# EasyEDA schematic 1-Schematic_LiveTelemtry.json
TITLE: Sheet_1; REV: 1.0; Date: 2025-11-05; Sheet: 1/1; Drawn By: zavierlau123; Company: Your Company
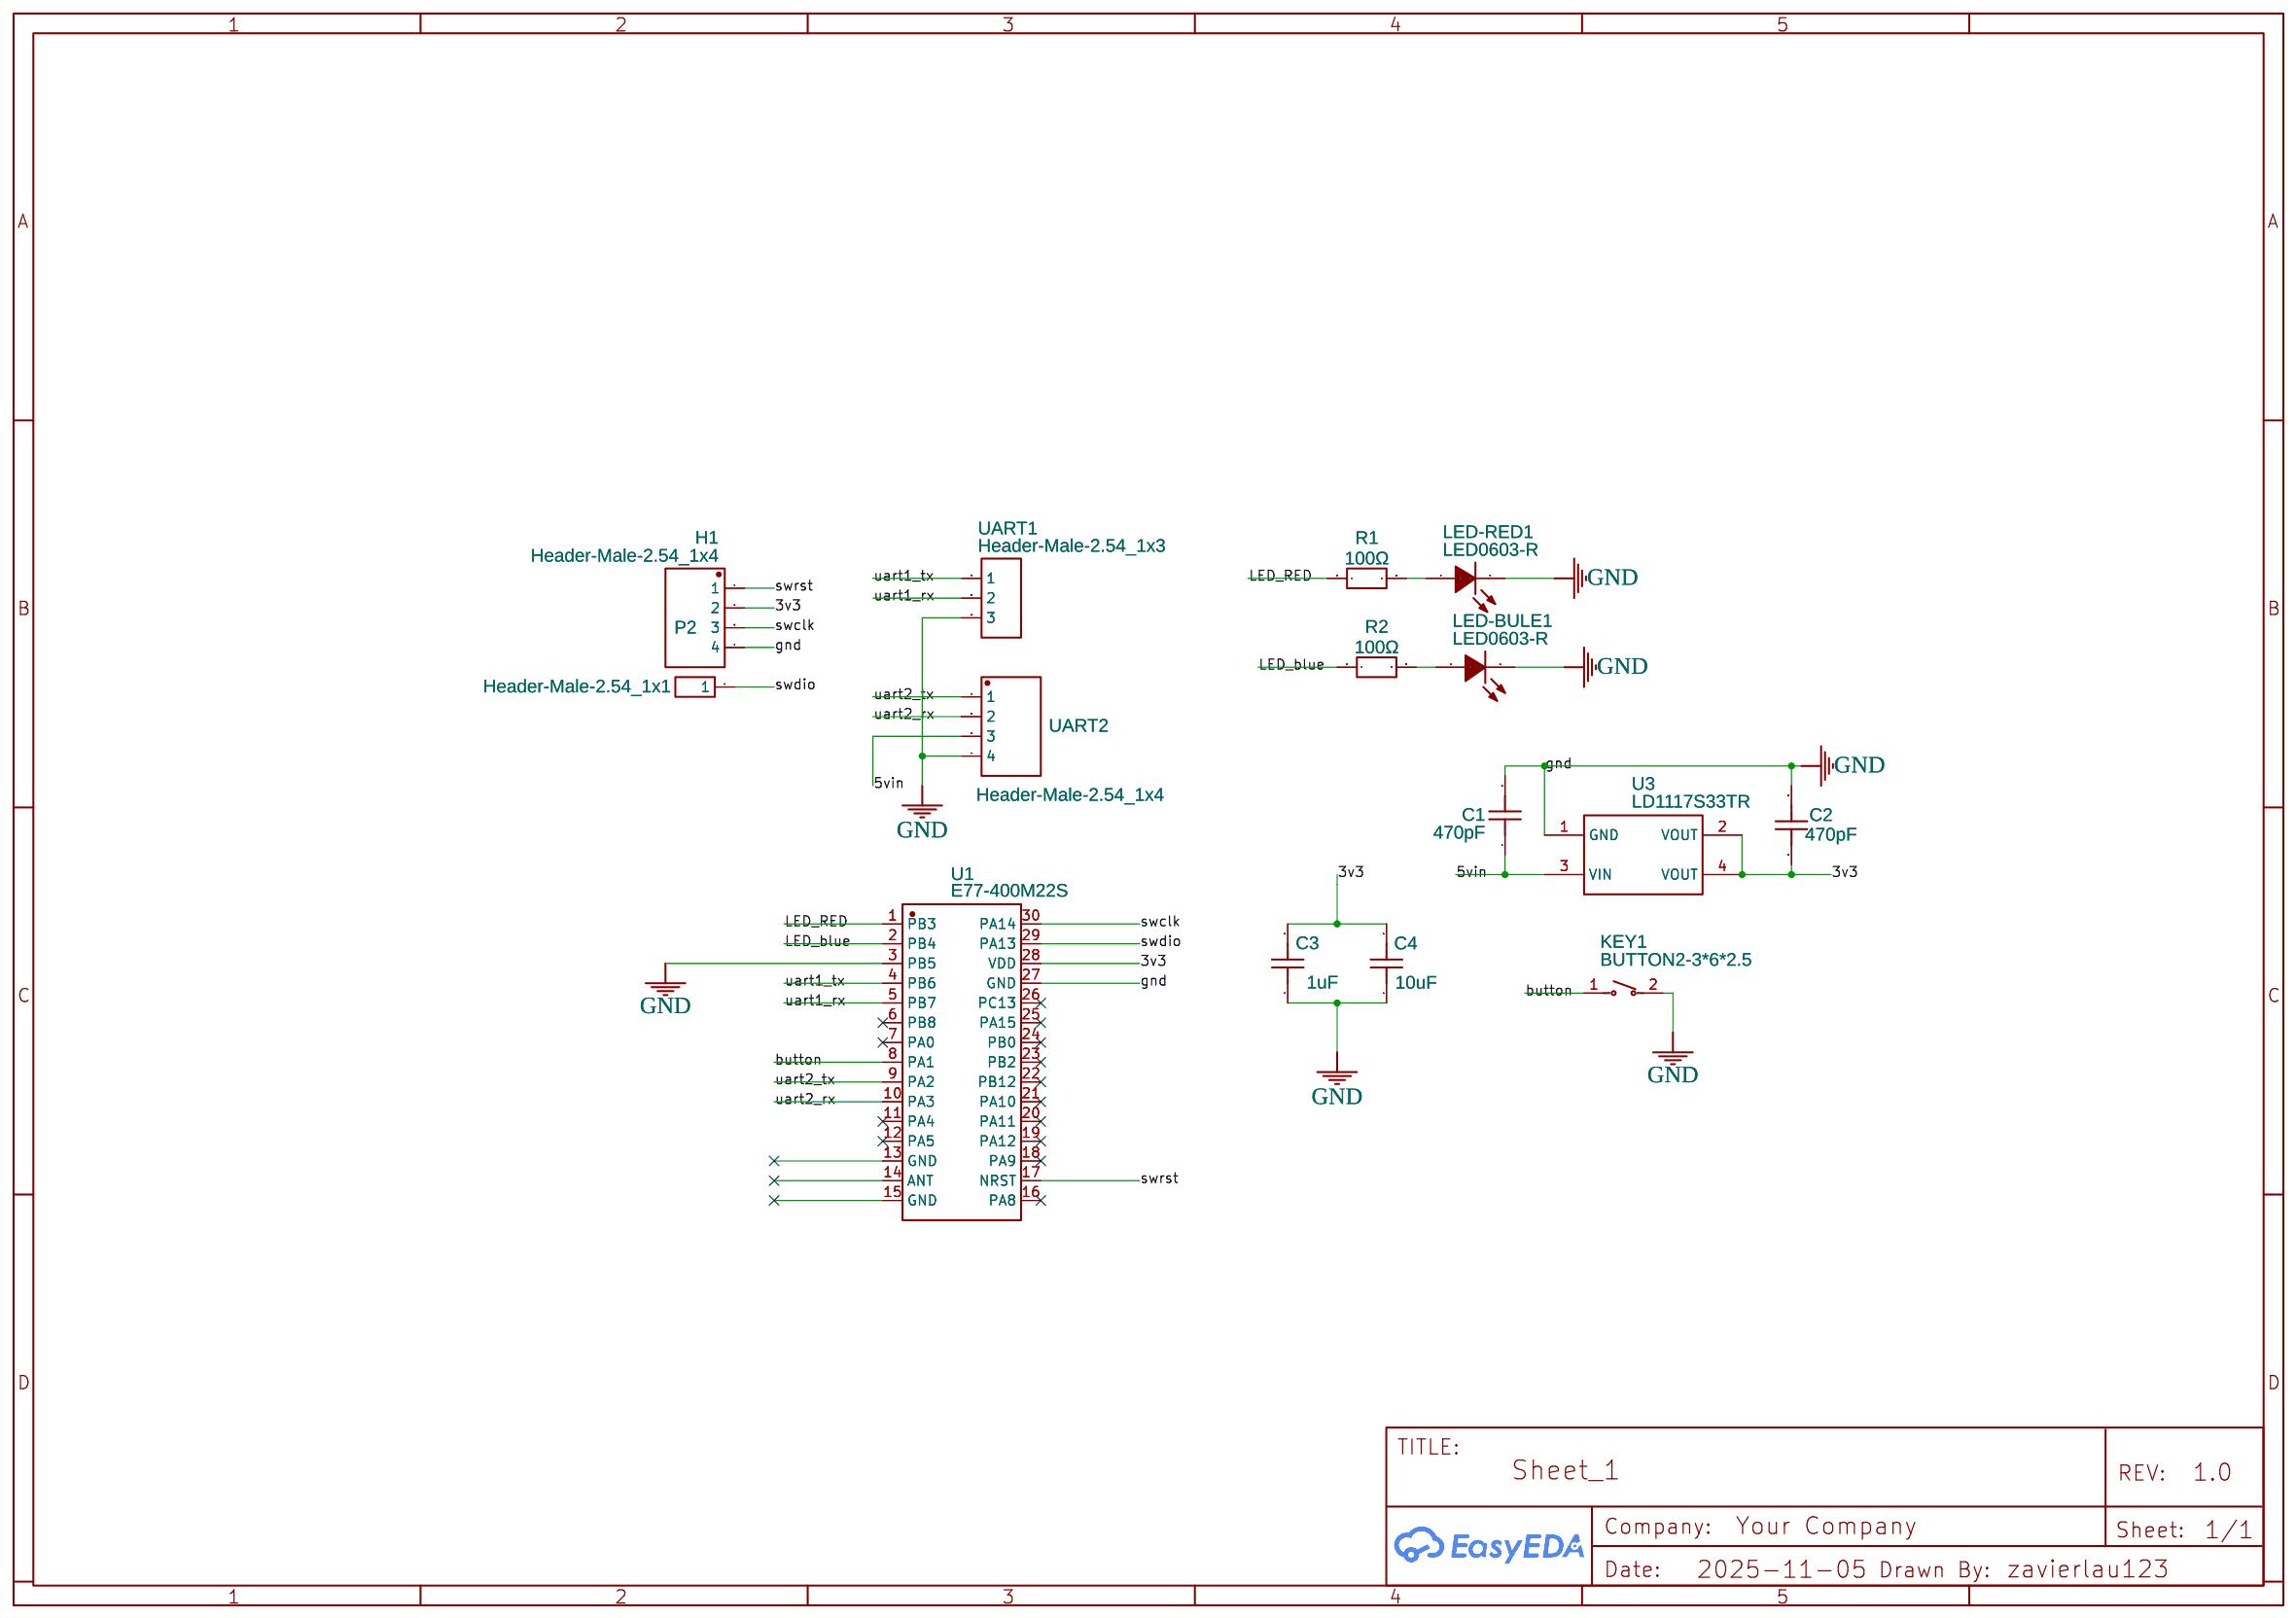
[diagram p0: schematic sheet]

## Parts
C1  470pF  [C0603]
C2  470pF  [C0603]
C3  1uF  [C0603]
C4  10uF  [C0603]
H1  Header-Male-2.54_1x4  [HDR-TH_4P-P2.54-V-M]
KEY1  BUTTON2-3*6*2.5  [SW-SMD_L6.0-W3.7-LS8.0]
LED-BULE1  LED0603-R  [LED0603-R-RD]
LED-RED1  LED0603-R  [LED0603-R-RD]
P2  Header-Male-2.54_1x1  [HDR-TH_1P-P2.54-V-M]
R1  100Ω  [R0603]
R2  100Ω  [R0603]
U1  E77-400M22S  [COMM-SMD_L20.0-W14.0_E77-400M22S]
U3  LD1117S33TR  [SOT-223_L6.5-W3.5-P2.30-LS7.0-BR]
UART1  Header-Male-2.54_1x3  [HDR-TH_3P-P2.54-V-M-1]
UART2  Header-Male-2.54_1x4  [HDR-TH_4P-P2.54-V-M]

## Library data of the parts
C1-C4 = C1608CH2A471J080AA: Contributor: lcsc; Supplier: LCSC; Supplier Part: C3878498; Manufacturer: TDK
H1 UART2 = Header-Male-2.54_1x4: Contributor: LCSC; Supplier: LCSC; Manufacturer: Ckmtw(灿科盟); Manufacturer Part: B-2100S04P-A110; Supplier Part: C124378; JLCPCB Part Class: Extended Part
KEY1 = BUTTON2-3*6*2.5: Contributor: LCSC; Supplier: LCSC; Supplier Part: C9900009018; Manufacturer: null
LED-BULE1 LED-RED1 = LED0603-R: Contributor: LCSC; Supplier: LCSC; Supplier Part: C9900005326; Manufacturer: null; JLCPCB Part Class: Extended Part
P2 = Header-Male-2.54_1x1: Supplier: LCSC; Manufacturer: BOOMELE(博穆精密); Manufacturer Part: 2.54-1*1P针; Supplier Part: C81276; JLCPCB Part Class: Extended Part
R1 R2 = HOAR0603-1/10W-100R-0.1%-TCR25: Contributor: lcsc; Supplier: LCSC; Supplier Part: C5123580; Manufacturer: Milliohm(毫欧); Manufacturer Part: HoAR0603-1/10W-100R-0.1%-TCR25; JLCPCB Part Class: Extended Part
U1 = E77-400M22S: Contributor: lcsc; Supplier: LCSC; Supplier Part: C5124421; Manufacturer: EBYTE(亿佰特); JLCPCB Part Class: Extended Part
U3 = LD1117S33TR: Contributor: LCSC; Supplier: LCSC; Supplier Part: C86781; Manufacturer: ST(意法半导体); JLCPCB Part Class: Extended Part
UART1 = Header-Male-2.54_1x3: Supplier: LCSC; Manufacturer: BOOMELE(博穆精密); Manufacturer Part: 2.54-1*3P针; Supplier Part: C49257; JLCPCB Part Class: Extended Part

## Nets
3v3: C2.1 C3.2 C4.2 H1.2 U1.28(VDD) U3.2(VOUT) U3.4(VOUT)
5vin: C1.1 U3.3(VIN) UART2.3
GND: C1.2 C2.2 C3.1 C4.1 H1.4 KEY1.2 LED-BULE1.2(K) LED-RED1.2(K) U1.3(PB5) U1.27(GND) U3.1(GND) UART1.3 UART2.4
button: KEY1.1 U1.8(PA1)
LED_blue: R2.1 U1.2(PB4)
LED_RED: R1.1 U1.1(PB3)
swclk: H1.3 U1.30(PA14)
swdio: P2.1 U1.29(PA13)
swrst: H1.1 U1.17(NRST)
uart1_rx: U1.5(PB7) UART1.2
uart1_tx: U1.4(PB6) UART1.1
uart2_rx: U1.10(PA3) UART2.2
uart2_tx: U1.9(PA2) UART2.1
Net-(LED-BULE1-1): LED-BULE1.1(A) R2.2
Net-(LED-RED1-1): LED-RED1.1(A) R1.2

Not connected (* = marked no-connect by the designer): U1 6(PB8)* 7(PA0)* 11(PA4)* 12(PA5)* 13(GND) 14(ANT) 15(GND) 16(PA8)* 18(PA9)* 19(PA12)* 20(PA11)* 21(PA10)* 22(PB12)* 23(PB2)* 24(PB0)* 25(PA15)* 26(PC13)*
